# EAGLE design ESP8266 + Serial Programming (EAGLE 7.3.0)
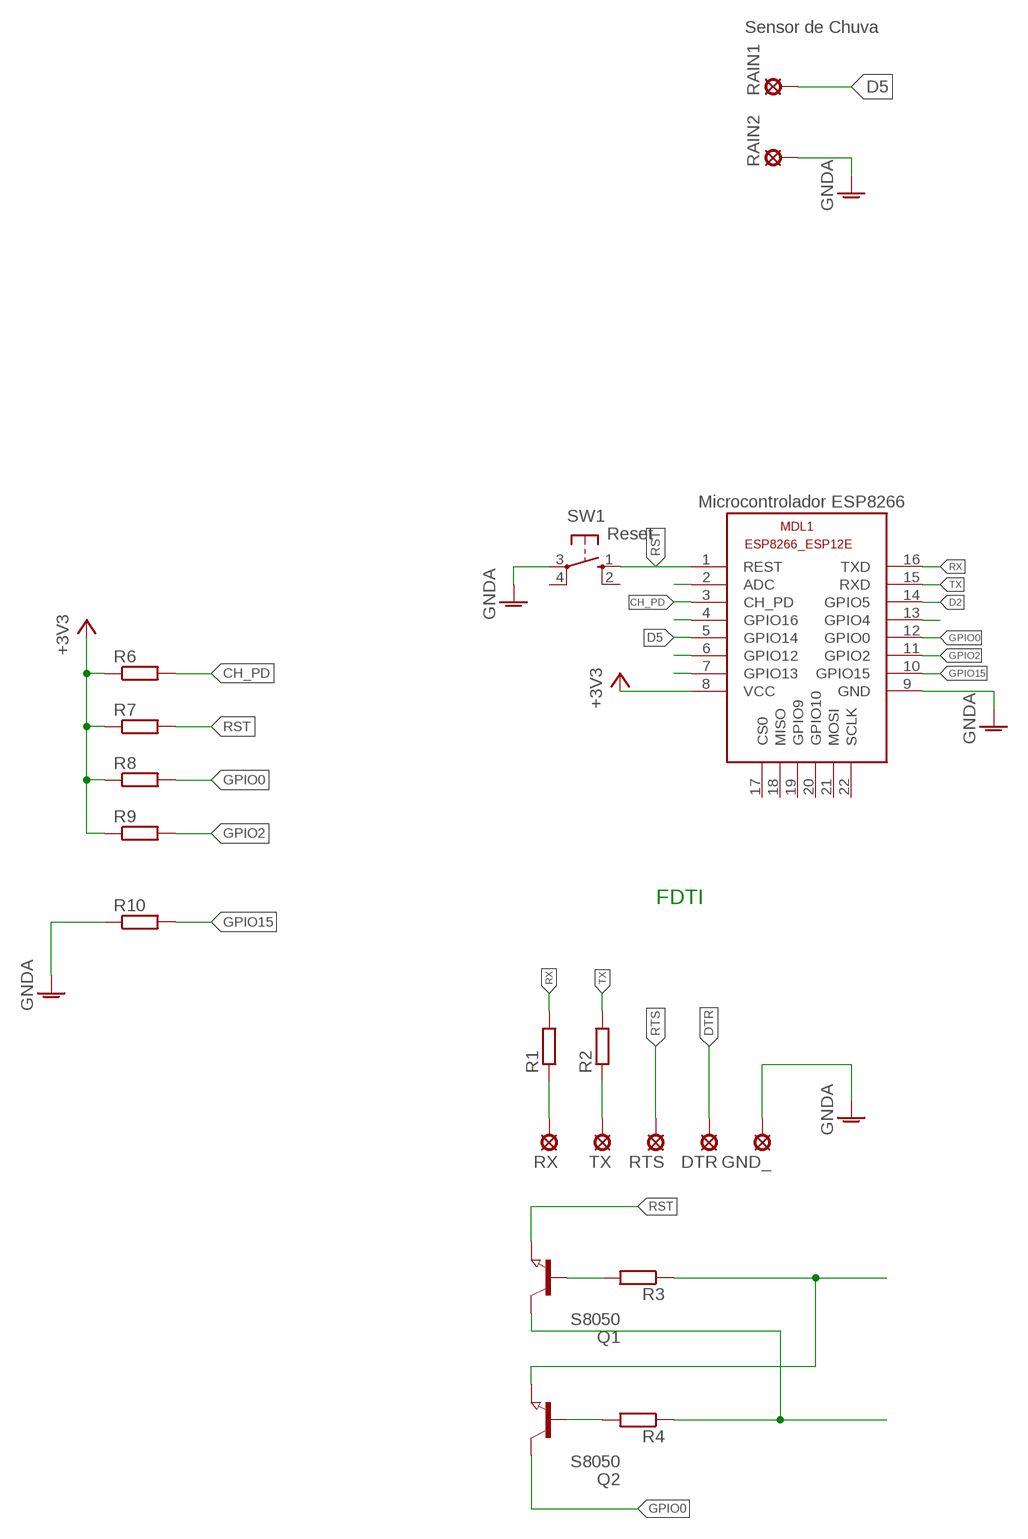
[diagram p0: schematic, sheet 1]

## Parts
DTR  LSP10  [LSP10]
GND_  LSP10  [LSP10]
MDL1  ESP8266-12EESP8266-ESP12E  [ESP8266-ESP12E]
Q1  S8050  NPN-TRANSISTOR_SOT23  [SOT23]
Q2  S8050  NPN-TRANSISTOR_SOT23  [SOT23]
R1  R-EU_R0805  [R0805]
R2  R-EU_R0805  [R0805]
R3  R-EU_R0805  [R0805]
R4  R-EU_R0805  [R0805]
R6  R-EU_R0805  [R0805]
R7  R-EU_R0805  [R0805]
R8  R-EU_R0805  [R0805]
R9  R-EU_R0805  [R0805]
R10  R-EU_R0805  [R0805]
RAIN1  LSP10  [LSP10]
RAIN2  LSP10  [LSP10]
RTS  LSP10  [LSP10]
RX  LSP10  [LSP10]
SW1  Reset  10-XX  [B3F-10XX]
TX  LSP10  [LSP10]

## Nets
+3V3: MDL1.8(VCC) R6.1 R7.1 R8.1 R9.1
CH_PD: MDL1.3(CH_PD) R6.2
D2: MDL1.14(GPIO5)
D5: MDL1.5(GPIO14) RAIN1.MP
DTR: DTR.MP Q2.2(E) R3.1
GND: MDL1.9(GND) RAIN2.MP SW1.3(P) ; supply symbol labelled GNDA
GNDA: GND_.MP R10.1
GPIO0: MDL1.12(GPIO0) Q2.3(C) R8.2
GPIO2: MDL1.11(GPIO2) R9.2
GPIO15: MDL1.10(GPIO15) R10.2
N$1: R1.1 RX.MP
N$2: R2.1 TX.MP
N$6: Q1.1(B) R3.2
N$7: Q2.1(B) R4.2
N$9: MDL1.13(GPIO4)
N$10: MDL1.7(GPIO13)
N$11: MDL1.4(GPIO16)
N$12: MDL1.6(GPIO12)
N$14: MDL1.2(ADC)
RST: MDL1.1(REST) Q1.2(E) R7.2 SW1.1(S)
RTS: Q1.3(C) R4.1 RTS.MP
RX: MDL1.16(TXD) R1.2
TX: MDL1.15(RXD) R2.2
Unconnected: MDL1.17(CS0) MDL1.18(MISO) MDL1.19(GPIO9) MDL1.20(GPIO10) MDL1.21(MOSI) MDL1.22(SCLK) SW1.2(S1) SW1.4(P1)

## Notes on the sheet
- Sensor de Chuva
- Microcontrolador ESP8266
- FDTI

## Library data of the parts
DTR GND_ RAIN1 RAIN2 RTS RX TX = solpad:LSP10: SOLDER PAD drill 1.0 mm, distributor Buerklin, 12H555
MDL1 = ESP8266-ESP12E:ESP8266-12E: ESP8266-12E with additional I/O and GPIO04/05 corrected The author cannot warrant that this library is free from error or will meet your specific requirements. Created by PuceBaboon.com. Komagane, Nagano, JAPAN
Q1 Q2 = semicon-smd-ipc:NPN-TRANSISTOR_: NPN TRANSISTOR
R1-R4 R6-R10 = wes:R-EU_: RESISTOR, European symbol
SW1 = buttons:10-XX: OMRON SWITCH

## Board
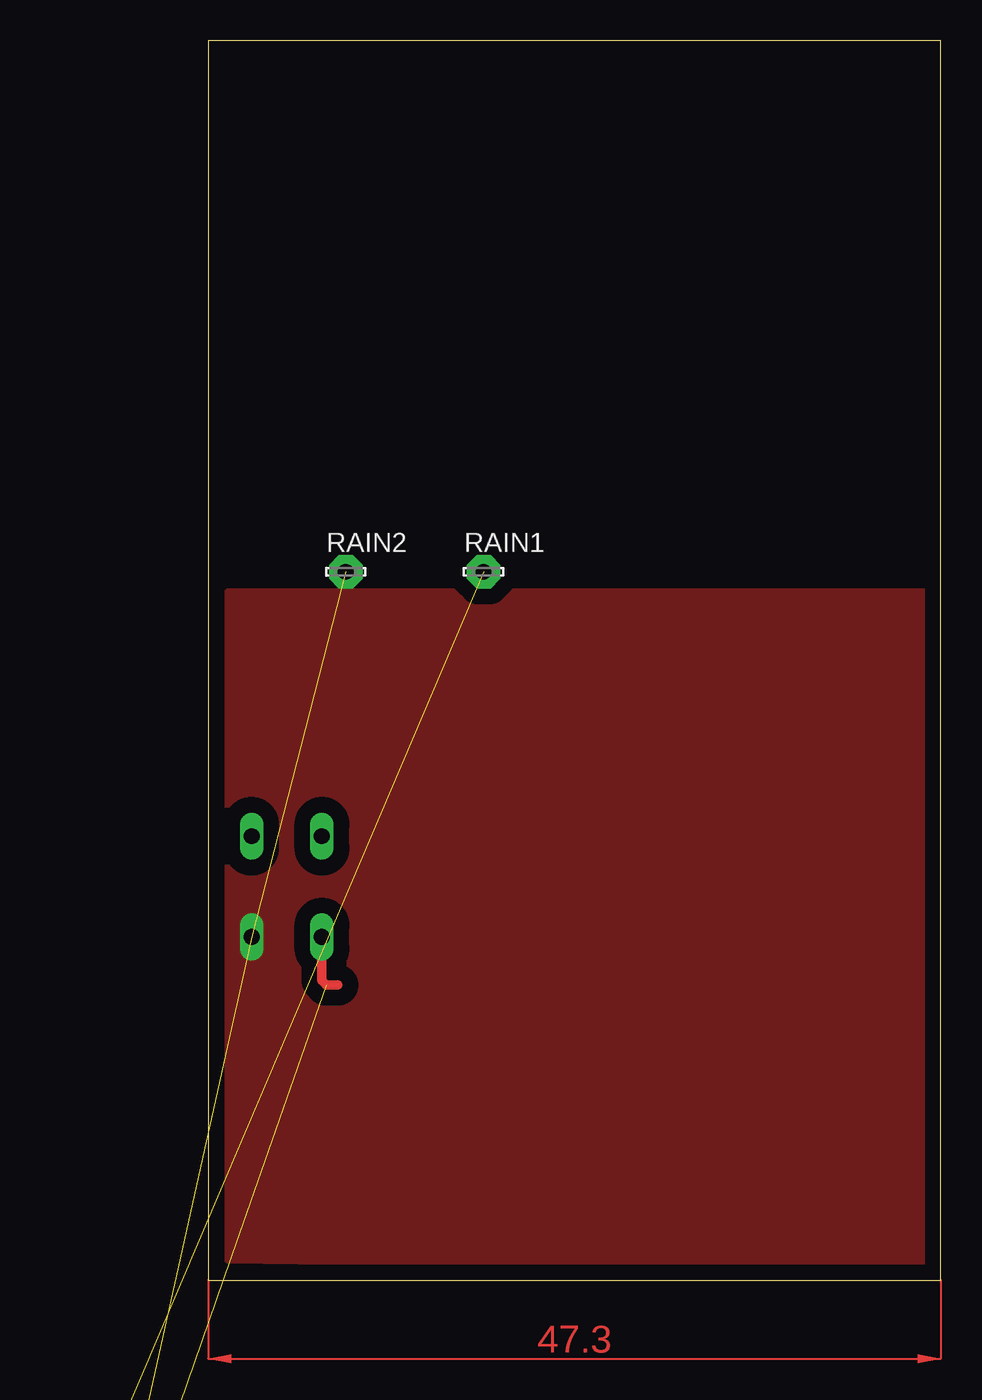
[diagram p1: board, top side]
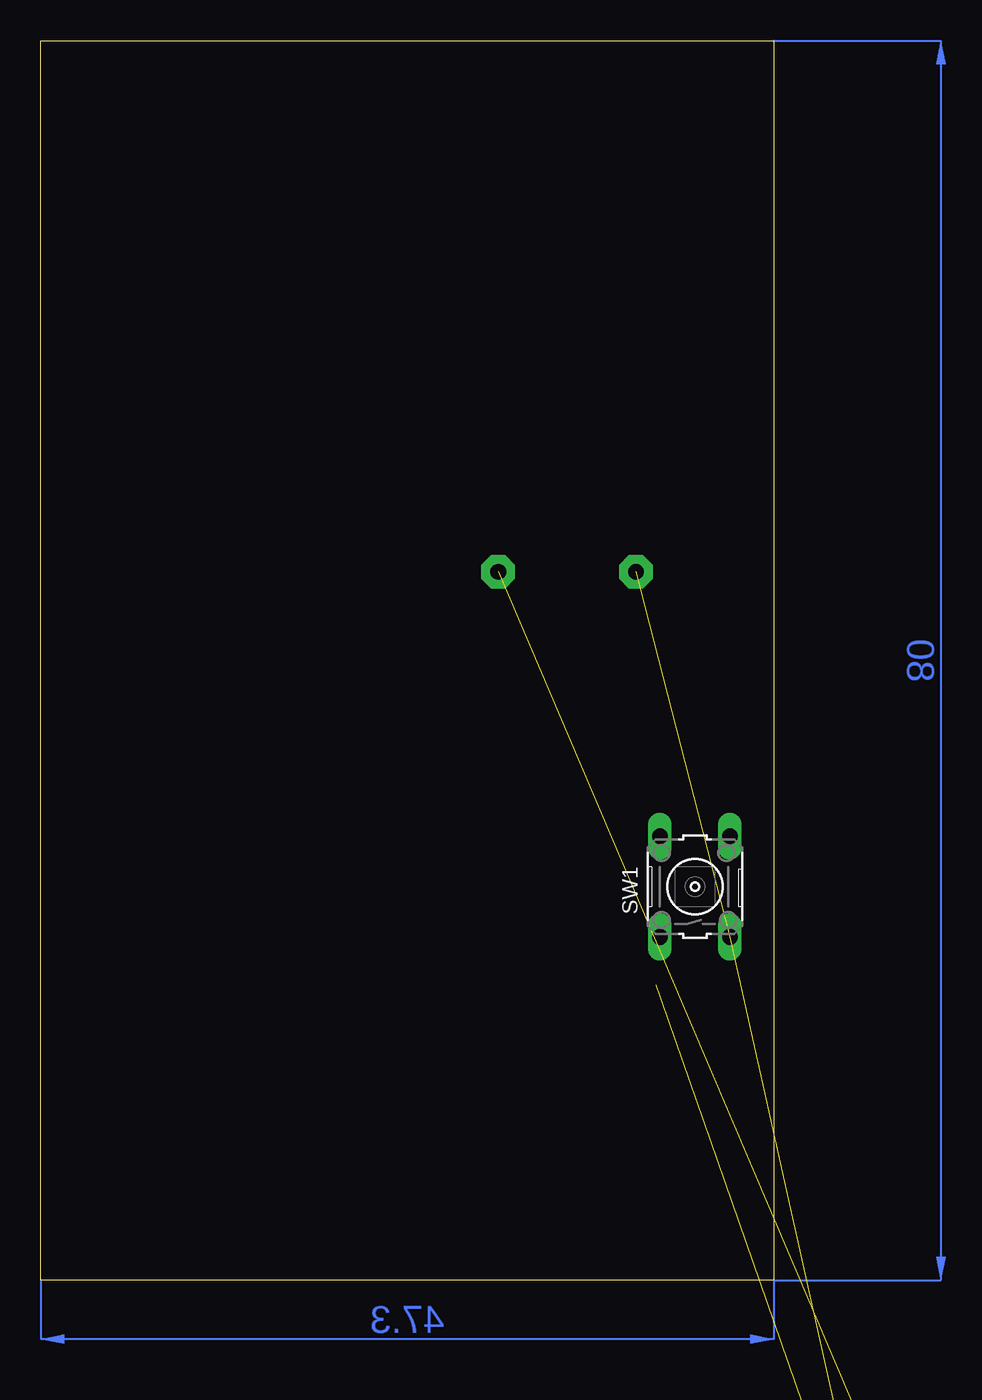
[diagram p2: board, bottom side, seen from below]

Size 47.3 x 80 mm. Coordinates in mm from the lower left corner, seen from the top.
Outline: 0,0 47.3,0 47.3,80 0,80 0,0
Copper layers (1*16): Top 0.035mm / dielectric 1.5mm / Bottom 0.035mm
Design rules "default": minimum track width 10mil, minimum drill 24mil, track to track 8mil, track to pad 8mil, pad to pad 8mil, via to via 8mil, smd to smd 8mil, copper to edge 40mil, drill to drill 8mil, minimum pad ring 10mil, minimum via ring 8mil, stop-mask expansion 4mil, vias tented up to drill 0mil, thermal gap 10mil

### Footprints (pad centres in the part's own frame; a part is rotated, then mirrored left to right if it is on the bottom)
LSP10 = drill 1.016 pad 2.159 octagon: MP 0,0
ESP8266-ESP12E = smd 2 x 1.2: 1 -7.62,5.84; 2 -7.62,3.84; 3 -7.62,1.84; 4 -7.62,-0.16; 5 -7.62,-2.16; 6 -7.62,-4.16; 7 -7.62,-6.16; 8 -7.62,-8.16; 9 8.58,-8.16; 10 8.58,-6.16; 11 8.58,-4.16; 12 8.58,-2.16; 13 8.58,-0.16; 14 8.58,1.84; 15 8.58,3.84; 16 8.58,5.84 | smd 1.2 x 2: 17 -4.62,-10.16; 18 -2.62,-10.16; 19 -0.62,-10.16; 20 1.38,-10.16; 21 3.38,-10.16; 22 5.38,-10.16
SOT23 = smd 1 x 1.4: 1 -0.95,-1.1; 2 0.95,-1.1; 3 0,1.1
R0805 = smd 1.1 x 1.4: 1 -0.875,0; 2 0.875,0
B3F-10XX = drill 1.016 long: 1 -3.251,2.261; 2 3.251,2.261; 3 -3.251,-2.261; 4 3.251,-2.261

### Placement (x,y rotation side)
DTR  -19.68,-31.11 0 top  (outside the outline)
GND_  -19.68,-35.56 0 top  (outside the outline)
MDL1  -31.75,-86.36 0 top  (outside the outline)
Q1  -19.05,-53.34 0 top  (outside the outline)
Q2  -19.05,-59.05 0 top  (outside the outline)
R1  -19.68,-89.53 0 top  (outside the outline)
R2  -19.68,-92.08 0 top  (outside the outline)
R3  -19.68,-94.61 0 top  (outside the outline)
R4  -19.68,-97.16 0 top  (outside the outline)
R6  -19.68,-76.83 0 top  (outside the outline)
R7  -19.68,-79.38 0 top  (outside the outline)
R8  -19.68,-81.92 0 top  (outside the outline)
R9  -19.68,-84.45 0 top  (outside the outline)
R10  -19.68,-87 0 top  (outside the outline)
RAIN1  17.78,45.72 0 top
RAIN2  8.89,45.72 0 top
RTS  -19.68,-26.67 0 top  (outside the outline)
RX  -19.68,-17.78 0 top  (outside the outline)
SW1  5.08,25.4 90 bottom
TX  -19.68,-22.23 0 top  (outside the outline)

### Tracks (layer width: path | path; a pad name or v marks a point on that pad's centre or on a via)
+3V3  (4 unrouted)
CH_PD  (1 unrouted)
D5  (1 unrouted)
DTR  (2 unrouted)
GND  (2 unrouted)
  pour Top (isolate 1.016, no thermals): 1.27,44.45 1.27,1.27 46.99,0.64 46.99,44.45
GNDA  (1 unrouted)
GPIO0  (2 unrouted)
GPIO2  (1 unrouted)
GPIO15  (1 unrouted)
N$1  (1 unrouted)
N$2  (1 unrouted)
N$6  (1 unrouted)
N$7  (1 unrouted)
RST  (3 unrouted)
  Top 0.61: SW1.1 7.34,19.33 7.62,19.05 8.38,19.05
RTS  (2 unrouted)
RX  (1 unrouted)
TX  (1 unrouted)
(copper drawn outside any net)
  shapes: Bottom area x2, Top area x1